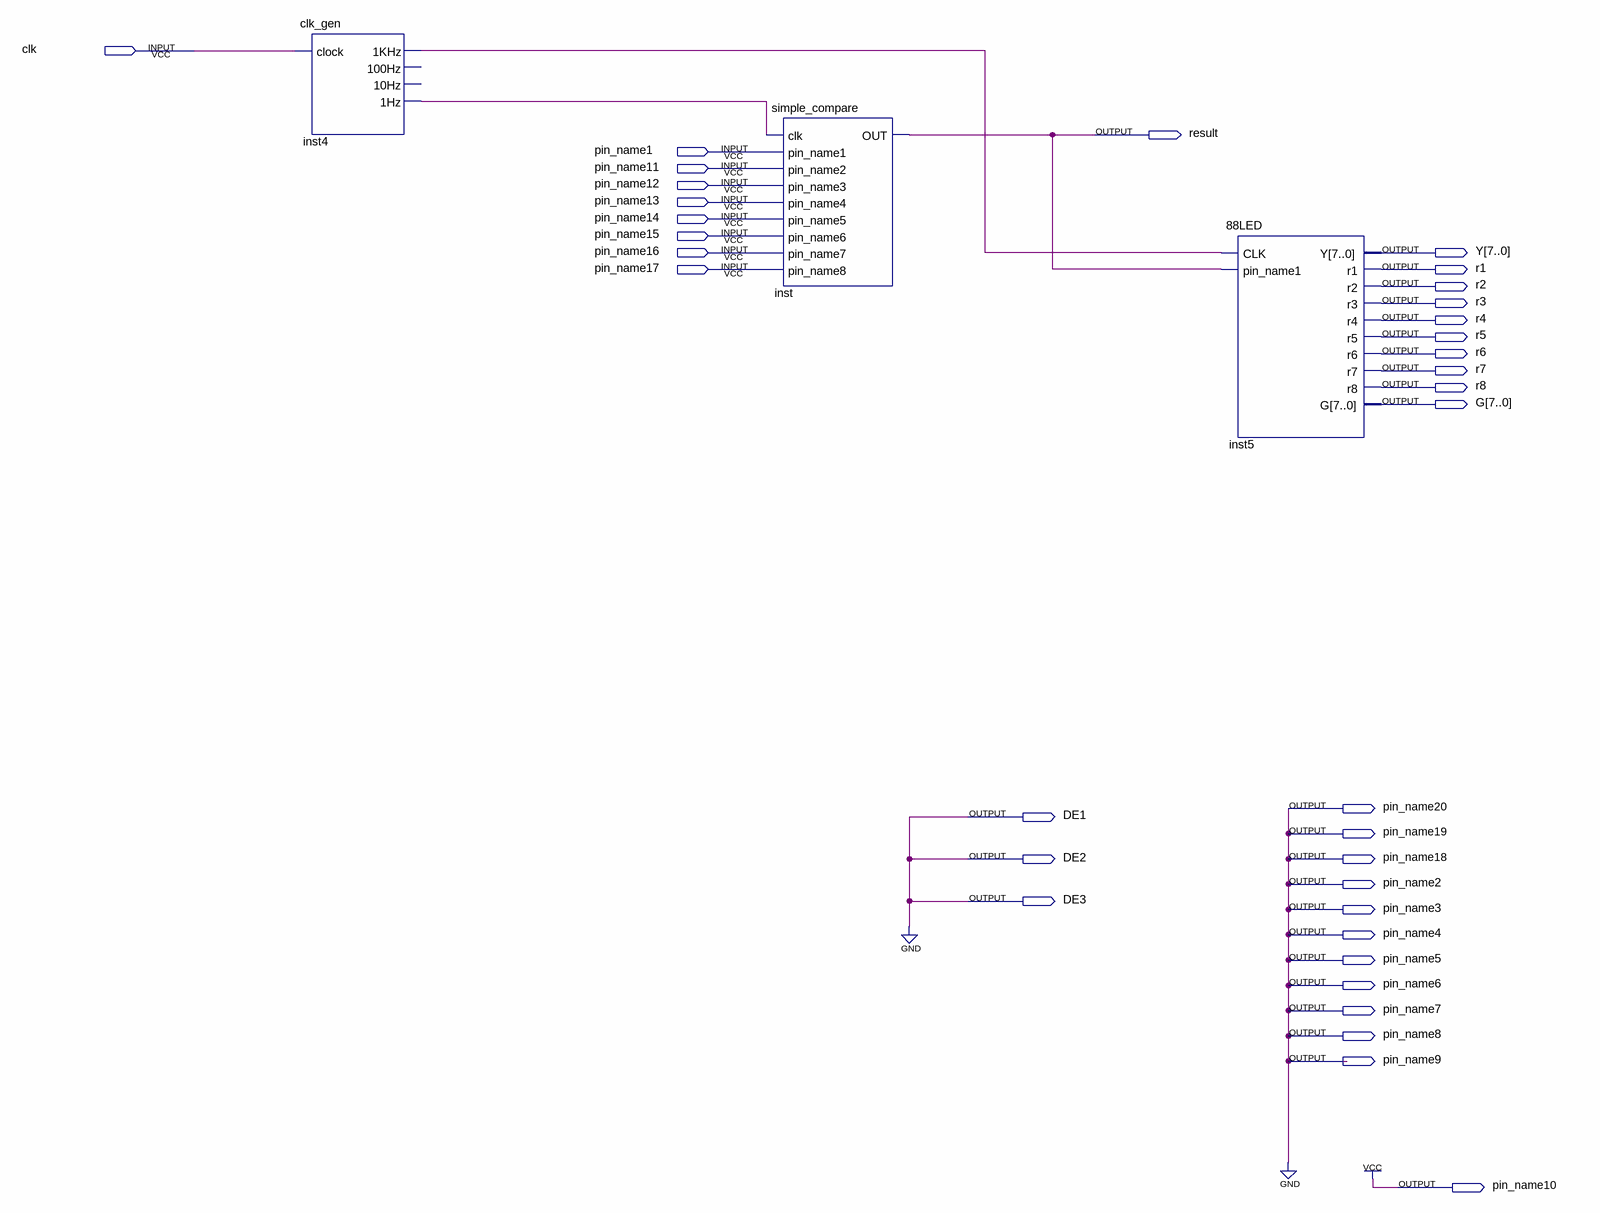
[diagram p0: schematic sheet]
// Quartus schematic num_switch.bdf as structural Verilog: 3 symbols, 35 pins
module num_switch (
  input  clk,
  input  pin_name1,
  input  pin_name11,
  input  pin_name12,
  input  pin_name13,
  input  pin_name14,
  input  pin_name15,
  input  pin_name16,
  input  pin_name17,
  output result,
  output [7:0] Y,
  output r1,
  output r2,
  output r3,
  output r4,
  output r5,
  output r6,
  output r7,
  output r8,
  output [7:0] G,
  output pin_name20,
  output DE1,
  output pin_name19,
  output DE2,
  output pin_name18,
  output pin_name2,
  output DE3,
  output pin_name3,
  output pin_name4,
  output pin_name5,
  output pin_name6,
  output pin_name7,
  output pin_name8,
  output pin_name9,
  output pin_name10
);

  wire inst4_1hz, inst4_1khz;

  clk_gen inst4 (.clock(clk), .\1KHz (inst4_1khz), .\1Hz (inst4_1hz));  // open: 100Hz, 10Hz
  simple_compare inst (
    .clk(inst4_1hz), .pin_name1(pin_name1), .pin_name2(pin_name11), .pin_name3(pin_name12),
    .pin_name4(pin_name13), .pin_name5(pin_name14), .pin_name6(pin_name15), .pin_name7(pin_name16),
    .pin_name8(pin_name17), .OUT(result));
  \88LED  inst5 (
    .CLK(inst4_1khz), .pin_name1(result), .Y(Y), .r1(r1), .r2(r2), .r3(r3), .r4(r4), .r5(r5), .r6(r6),
    .r7(r7), .r8(r8), .G(G));

  assign DE1 = 1'b0;
  assign DE2 = 1'b0;
  assign DE3 = 1'b0;
  assign pin_name2 = 1'b0;
  assign pin_name3 = 1'b0;
  assign pin_name4 = 1'b0;
  assign pin_name5 = 1'b0;
  assign pin_name6 = 1'b0;
  assign pin_name7 = 1'b0;
  assign pin_name8 = 1'b0;
  assign pin_name9 = 1'b0;
  assign pin_name10 = 1'b1;
  assign pin_name18 = 1'b0;
  assign pin_name19 = 1'b0;
  assign pin_name20 = 1'b0;
endmodule
